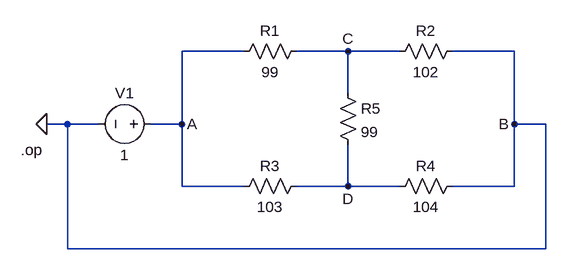
[diagram p0: schematic Circuit2.asc]
Circuit2.asc, the LTspice schematic file:
Version 4
SHEET 1 880 680
WIRE 64 144 -32 144
WIRE 224 144 144 144
WIRE 304 144 224 144
WIRE 480 144 384 144
WIRE 224 208 224 144
WIRE -208 256 -240 256
WIRE -160 256 -208 256
WIRE -32 256 -32 144
WIRE -32 256 -80 256
WIRE 480 256 480 144
WIRE 528 256 480 256
WIRE -32 352 -32 256
WIRE 64 352 -32 352
WIRE 224 352 224 288
WIRE 224 352 144 352
WIRE 304 352 224 352
WIRE 480 352 480 256
WIRE 480 352 384 352
WIRE -208 448 -208 256
WIRE 528 448 528 256
WIRE 528 448 -208 448
FLAG -240 256 0
FLAG -32 256 A
FLAG 224 352 D
FLAG 224 144 C
FLAG 480 256 B
SYMBOL res 160 128 R90
WINDOW 0 0 56 VBottom 2
WINDOW 3 32 56 VTop 2
SYMATTR InstName R1
SYMATTR Value 99
SYMBOL res 400 128 R90
WINDOW 0 0 56 VBottom 2
WINDOW 3 32 56 VTop 2
SYMATTR InstName R2
SYMATTR Value 102
SYMBOL res 160 336 R90
WINDOW 0 0 56 VBottom 2
WINDOW 3 32 56 VTop 2
SYMATTR InstName R3
SYMATTR Value 103
SYMBOL res 400 336 R90
WINDOW 0 0 56 VBottom 2
WINDOW 3 32 56 VTop 2
SYMATTR InstName R4
SYMATTR Value 104
SYMBOL voltage -64 256 R90
WINDOW 0 -32 56 VBottom 2
WINDOW 3 32 56 VTop 2
WINDOW 123 0 0 Left 0
WINDOW 39 0 0 Left 0
SYMATTR InstName V1
SYMATTR Value 1
SYMBOL res 208 192 R0
SYMATTR InstName R5
SYMATTR Value 99
TEXT -280 296 Left 2 !.op

The netlist it stands for:
* Circuit2.asc
R1 C A 99
R2 0 C 102
R3 D A 103
R4 0 D 104
V1 A 0 1
R5 C D 99
.op
.backanno
.end